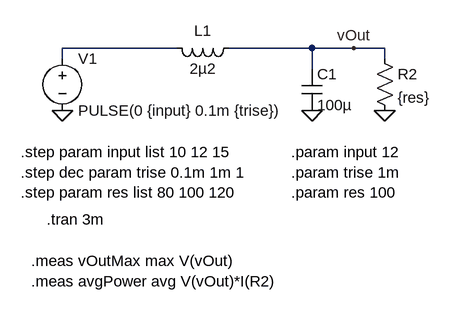
[diagram p0: schematic Demo.asc]
Demo.asc, the LTspice schematic file:
Version 4
SHEET 1 880 680
WIRE 176 80 0 80
WIRE 384 80 256 80
WIRE 448 80 384 80
WIRE 496 80 448 80
WIRE 0 96 0 80
WIRE 496 96 496 80
WIRE 384 112 384 80
FLAG 0 176 0
FLAG 384 176 0
FLAG 496 176 0
FLAG 448 80 vOut
SYMBOL voltage 0 80 R0
WINDOW 123 0 0 Left 2
WINDOW 39 0 0 Left 2
SYMATTR InstName V1
SYMATTR Value PULSE(0 {input} 0.1m {trise})
SYMBOL ind 272 64 R90
WINDOW 0 5 56 VBottom 2
WINDOW 3 32 56 VTop 2
SYMATTR InstName L1
SYMATTR Value 2µ2
SYMATTR SpiceLine Rser=0.02
SYMBOL cap 368 112 R0
SYMATTR InstName C1
SYMATTR Value 100µ
SYMATTR SpiceLine Rser=0.05
SYMBOL res 480 80 R0
SYMATTR InstName R2
SYMATTR Value {res}
TEXT 352 240 Left 2 !.param input 12\n.param trise 1m\n.param res 100
TEXT -24 344 Left 2 !.tran 3m
TEXT -64 240 Left 2 !.step param input list 10 12 15\n.step dec param trise 0.1m 1m 1\n.step param res list 80 100 120
TEXT -48 408 Left 2 !.meas vOutMax max V(vOut)\n.meas avgPower avg V(vOut)*I(R2)

The netlist it stands for:
* Demo.asc
V1 N001 0 PULSE(0 {input} 0.1m {trise})
L1 vOut N001 2µ2 Rser=0.02
C1 vOut 0 100µ Rser=0.05
R2 vOut 0 {res}
.param input 12
.param trise 1m
.param res 100
.tran 3m
.step param input list 10 12 15
.step dec param trise 0.1m 1m 1
.step param res list 80 100 120
.meas vOutMax max V(vOut)
.meas avgPower avg V(vOut)*I(R2)
.backanno
.end